# EAGLE design MK (EAGLE 9.4.2)
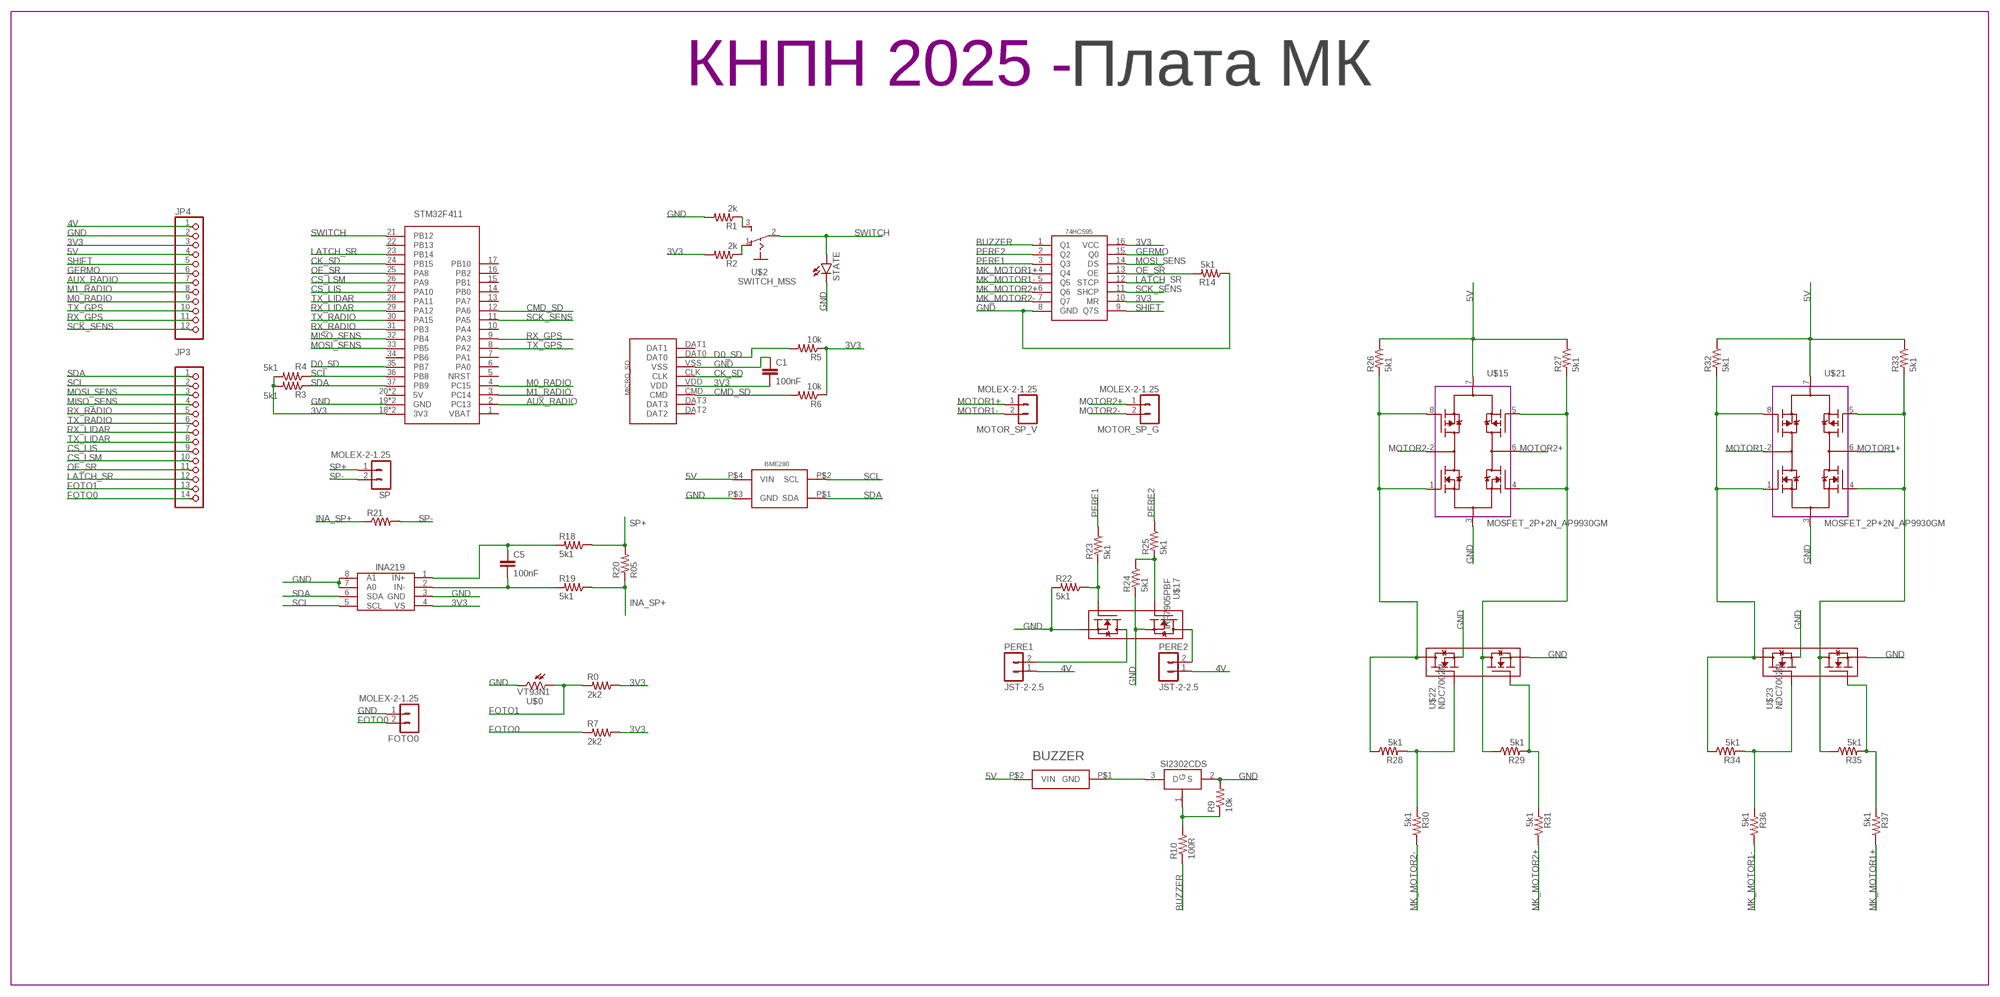
[diagram p0: schematic, sheet 1]

## Parts
BME280  BME280BME280-PINS-ONLY  [BME280-PINS-ONLY]
BUZZER  BUZZERS8R6  [BUZZER-S8R12]
C1  100nF  C-EUC0603  [C0603]
C5  100nF  C-EUC0603  [C0603]
FOTO0  MOLEX-2-1.25  [53047-02]
JP3  PINHD-1X14  [1X14]
JP4  PINHD-1X12  [1X12]
MICRO_SD  SD  [SD]
MOTOR_SP_G  MOLEX-2-1.25  [53047-02]
MOTOR_SP_V  MOLEX-2-1.25  [53047-02]
PERE1  JST-2-2.5  [JST-2-2.5]
PERE2  JST-2-2.5  [JST-2-2.5]
R0  2k2  R-US_R0603  [R0603]
R1  2k  R-US_R0603  [R0603]
R2  2k  R-US_R0603  [R0603]
R3  5k1  R-US_R0603  [R0603]
R4  5k1  R-US_R0603  [R0603]
R5  10k  R-US_R0603  [R0603]
R6  10k  R-US_R0603  [R0603]
R7  2k2  R-US_R0603  [R0603]
R9  10k  R-US_R0603  [R0603]
R10  100R  R-US_R0603  [R0603]
R14  5k1  R-US_R0603  [R0603]
R18  5k1  R-US_R0603  [R0603]
R19  5k1  R-US_R0603  [R0603]
R20  R05  R-US_R2512  [R2512]
R21  R-US_0207/15  [0207/15]
R22  5k1  R-US_R0603  [R0603]
R23  5k1  R-US_R0603  [R0603]
R24  5k1  R-US_R0603  [R0603]
R25  5k1  R-US_R0603  [R0603]
R26  5k1  R-US_R0603  [R0603]
R27  5k1  R-US_R0603  [R0603]
R28  5k1  R-US_R0603  [R0603]
R29  5k1  R-US_R0603  [R0603]
R30  5k1  R-US_R0603  [R0603]
R31  5k1  R-US_R0603  [R0603]
R32  5k1  R-US_R0603  [R0603]
R33  5k1  R-US_R0603  [R0603]
R34  5k1  R-US_R0603  [R0603]
R35  5k1  R-US_R0603  [R0603]
R36  5k1  R-US_R0603  [R0603]
R37  5k1  R-US_R0603  [R0603]
SI2302CDS  SI2302CDS  [SOT23-3]
SP  MOLEX-2-1.25  [53047-02]
STATE  LEDCHIPLED_0603  [CHIPLED_0603]
STM32F411  STM32F411_BOARD  [STM32F411_BOARD]
U$0  VT93N1  [VT93N1]
U$1  Плата МК  LOGOPCB-""  [LOGO]
U$2  SWITCH_MSS  [SWITCH_MSS]
U$13  74HC595  [TSSOP16]
U$15  MOSFET_2P+2N_AP9930GM  [SO8]
U$16  INA219AID  [SOT23-8]
U$17  IRF7905PBF  [SO8]
U$21  MOSFET_2P+2N_AP9930GM  [SO8]
U$22  NDC7002N  [SOT23-6]
U$23  NDC7002N  [SOT23-6]

## Nets
3V3: C1.2 JP4.3 MICRO_SD.VDD R0.1 R2.2 R3.2 R4.2 R5.1 R6.1 R7.1 STM32F411.18(3V3) STM32F411.40(3V3) U$13.10(MR) U$13.16(VCC) U$16.4(VS)
4V: JP4.1 PERE1.1 PERE2.1
5V: BME280.P$4(VIN) BUZZER.P$2(VIN) JP4.4 R26.1 R27.1 R32.1 R33.1 U$15.7(P1P2S) U$21.7(P1P2S)
AUX_RADIO: JP4.7 STM32F411.2(PC13)
BUZZER: R10.1 U$13.1(Q1)
CK_SD: MICRO_SD.CLK STM32F411.24(PB15)
CMD_SD: MICRO_SD.CMD R6.2 STM32F411.12(PA6)
CS_LIS: JP3.9 STM32F411.27(PA10)
CS_LSM: JP3.10 STM32F411.26(PA9)
D0_SD: MICRO_SD.DAT0 R5.2 STM32F411.35(PB7)
FOTO0: FOTO0.2 JP3.14 R7.2
FOTO1: JP3.13 R0.2 U$0.P$1
GERMO: JP4.6 U$13.15(Q0)
GND: BME280.P$3(GND) C1.1 FOTO0.1 JP4.2 MICRO_SD.VSS R1.2 R9.2 R14.1 R22.2 R24.2 SI2302CDS.2(S) STATE.C STM32F411.19(GND) STM32F411.39(GND) U$0.P$2 U$13.8(GND) U$15.3(N1N2S) U$16.3(GND) U$16.7(A0) U$16.8(A1) U$17.1(S2) U$17.3(S1) U$21.3(N1N2S) U$22.2(S2) U$22.5(S1) U$23.2(S2) U$23.5(S1)
INA_SP+: R19.1 R20.1 R21.1
LATCH_SR: JP3.12 STM32F411.23(PB14) U$13.12(STCP)
M0_RADIO: JP4.9 STM32F411.4(PC15)
M1_RADIO: JP4.8 STM32F411.3(PC14)
MISO_SENS: JP3.4 STM32F411.32(PB4)
MK_MOTOR1+: R37.1 U$13.4(Q4)
MK_MOTOR1-: R36.1 U$13.5(Q5)
MK_MOTOR2+: R31.1 U$13.6(Q6)
MK_MOTOR2-: R30.1 U$13.7(Q7)
MOSI_SENS: JP3.3 STM32F411.33(PB5) U$13.14(DS)
MOTOR1+: MOTOR_SP_V.1 U$21.6(P2N2D)
MOTOR1-: MOTOR_SP_V.2 U$21.2(P1N1D)
MOTOR2+: MOTOR_SP_G.1 U$15.6(P2N2D)
MOTOR2-: MOTOR_SP_G.2 U$15.2(P1N1D)
N$1: R1.1 U$2.3(S)
N$2: R2.1 U$2.1(O)
N$13: BUZZER.P$1(GND) SI2302CDS.3(D)
N$14: R9.1 R10.2 SI2302CDS.1(G)
N$15: C5.2 R19.2 U$16.2(IN-)
N$18: C5.1 R18.2 U$16.1(IN+)
N$20: PERE1.2 U$17.7(D2) U$17.8(D2)
N$21: PERE2.2 U$17.5(D1) U$17.6(D1)
N$22: R22.1 R23.2 U$17.2(G2)
N$23: R24.1 R25.2 U$17.4(G1)
N$24: R32.2 R34.1 U$21.1(N1G) U$21.8(P1G) U$23.6(D1)
N$25: R26.2 R28.1 U$15.1(N1G) U$15.8(P1G) U$22.6(D1)
N$26: R27.2 R29.1 U$15.4(N2G) U$15.5(P2G) U$22.4(D2)
N$27: R33.2 R35.1 U$21.4(N2G) U$21.5(P2G) U$23.4(D2)
N$28: R34.2 R36.2 U$23.1(G1)
N$29: R35.2 R37.2 U$23.3(G2)
N$32: R28.2 R30.2 U$22.1(G1)
N$35: R29.2 R31.2 U$22.3(G2)
OE_SR: JP3.11 R14.2 STM32F411.25(PA8) U$13.13(OE)
PERE1: R23.1 U$13.3(Q3)
PERE2: R25.1 U$13.2(Q2)
RX_GPS: JP4.11 STM32F411.9(PA3)
RX_LIDAR: JP3.7 STM32F411.29(PA12)
RX_RADIO: JP3.5 STM32F411.31(PB3)
SCK_SENS: JP4.12 STM32F411.11(PA5) U$13.11(SHCP)
SCL: BME280.P$2(SCL) JP3.2 R4.1 STM32F411.36(PB8) U$16.5(SCL)
SDA: BME280.P$1(SDA) JP3.1 R3.1 STM32F411.37(PB9) U$16.6(SDA)
SHIFT: JP4.5 U$13.9(Q7S)
SP+: R18.1 R20.2 SP.1
SP-: R21.2 SP.2
SWITCH: STATE.A STM32F411.21(PB12) U$2.2(P)
TX_GPS: JP4.10 STM32F411.8(PA2)
TX_LIDAR: JP3.8 STM32F411.28(PA11)
TX_RADIO: JP3.6 STM32F411.30(PA15)
Unconnected: MICRO_SD.DAT1 MICRO_SD.DAT2 MICRO_SD.DAT3 STM32F411.1(VBAT) STM32F411.5(NRST) STM32F411.6(PA0) STM32F411.7(PA1) STM32F411.10(PA4) STM32F411.13(PA7) STM32F411.14(PB0) STM32F411.15(PB1) STM32F411.16(PB2) STM32F411.17(PB10) STM32F411.20(5V) STM32F411.22(PB13) STM32F411.34(PB6) STM32F411.38(5V)

## Library data of the parts
BME280 = UNKNOWN-2024:BME280
BUZZER = CanCubeSat:BUZZER
C1 C5 = rcl:C-EU: CAPACITOR, European symbol; SPICEPREFIX: C
FOTO0 MOTOR_SP_G MOTOR_SP_V SP = UNKNOWN-2024:MOLEX-2-1.25
JP3 = pinhead:PINHD-1X14: PIN HEADER
JP4 = pinhead:PINHD-1X12: PIN HEADER
MICRO_SD = UNKNOWN-2024:SD
PERE1 PERE2 = UNKNOWN-2024:JST-2-2.5: JST PH series header 2.00mm pitch disconnectable crimp style connectors, vertical (side entry type), 2 pins
R0 R1-R7 R9 R10 R14 R18-R37 = rcl:R-US_: RESISTOR, American symbol; SPICEPREFIX: R
SI2302CDS = CanCubeSat:SI2302CDS
STATE = led:LED: LED OSRAM: - CHIPLED LG R971, LG N971, LY N971, LG Q971, LY Q971, LO R971, LY R971 LH N974, LH R974 LS Q976, LO Q976, LY Q976 LO Q996 - Hyper CHIPLED LW Q18S LB Q993, LB Q99A, LB R99A - SideLED LS A670, LO A670, LY A670, LG A670, LP A670 LB A673, LV A673, LT A673, LW A673 LH A674 LY A675 LS A676, LA A676, LO A676, LY A676, LW A676 LS A679, LY A679, LG A679 - Hyper Micro SIDELED® LS Y876, LA Y876, LO Y876, LY Y876 LT Y87S - SmartLED LW L88C, LW L88S LB L89C, LB L89S, LG L890 LS L89K, LO L89K, LY L89K LS L896, LA L896, LO L896, LY L896 - TOPLED LS T670, LO T670, LY T670, LG T670, LP T670 LSG T670, LSP T670, LSY T670, LOP T670, LYG T670 LG T671, LOG T671, LSG T671 LB T673, LV T673, LT T673, LW T673 LH T674 LS T676, LA T676, LO T676, LY T676, LB T676, LH T676, LSB T676, LW T676 LB T67C, LV T67C, LT T67C, LS T67K, LO T67K, LY T67K, LW E67C LS E67B, LA E67B, LO E67B, LY E67B, LB E67C, LV E67C, LT E67C LW T67C LS T679, LY T679, LG T679 LS T770, LO T770, LY T770, LG T770, LP T770 LB T773, LV T773, LT T773, LW T773 LH T774 LS E675, LA E675, LY E675, LS T675 LS T776, LA T776, LO T776, LY T776, LB T776 LHGB T686 LT T68C, LB T68C - Hyper Mini TOPLED® LB M676 - Mini TOPLED Santana® LG M470 LS M47K, LO M47K, LY M47K Source: http://www.osram.convergy.de LUXEON: - LUMILED® LXK2-PW12-R00, LXK2-PW12-S00, LXK2-PW14-U00, LXK2-PW14-V00 LXK2-PM12-R00, LXK2-PM12-S00, LXK2-PM14-U00 LXK2-PE12-Q00, LXK2-PE12-R00, LXK2-PE12-S00, LXK2-PE14-T00, LXK2-PE14-U00 LXK2-PB12-K00, LXK2-PB12-L00, LXK2-PB12-M00, LXK2-PB14-N00, LXK2-PB14-P00, LXK2-PB14-Q00 LXK2-PR12-L00, LXK2-PR12-M00, LXK2-PR14-Q00, LXK2-PR14-R00 LXK2-PD12-Q00, LXK2-PD12-R00, LXK2-PD12-S00 LXK2-PH12-R00, LXK2-PH12-S00 LXK2-PL12-P00, LXK2-PL12-Q00, LXK2-PL12-R00 Source: www.luxeon.com KINGBRIGHT: KA-3528ASYC Source: www.kingbright.com
STM32F411 = UNKNOWN-2024:STM32F411_BOARD
U$0 = KNPN-2023:VT93N1
U$1 = UNKNOWN-2024:LOGO
U$2 = UNKNOWN-2024:SWITCH_MSS
U$13 = CanCubeSat:74HC595
U$15 U$21 = UNKNOWN-2024:MOSFET_2P+2N_AP9930GM
U$16 = CanCubeSat:INA219AID
U$17 = UNKNOWN-2024:IRF7905PBF
U$22 U$23 = UNKNOWN-2024:NDC7002N

## Board
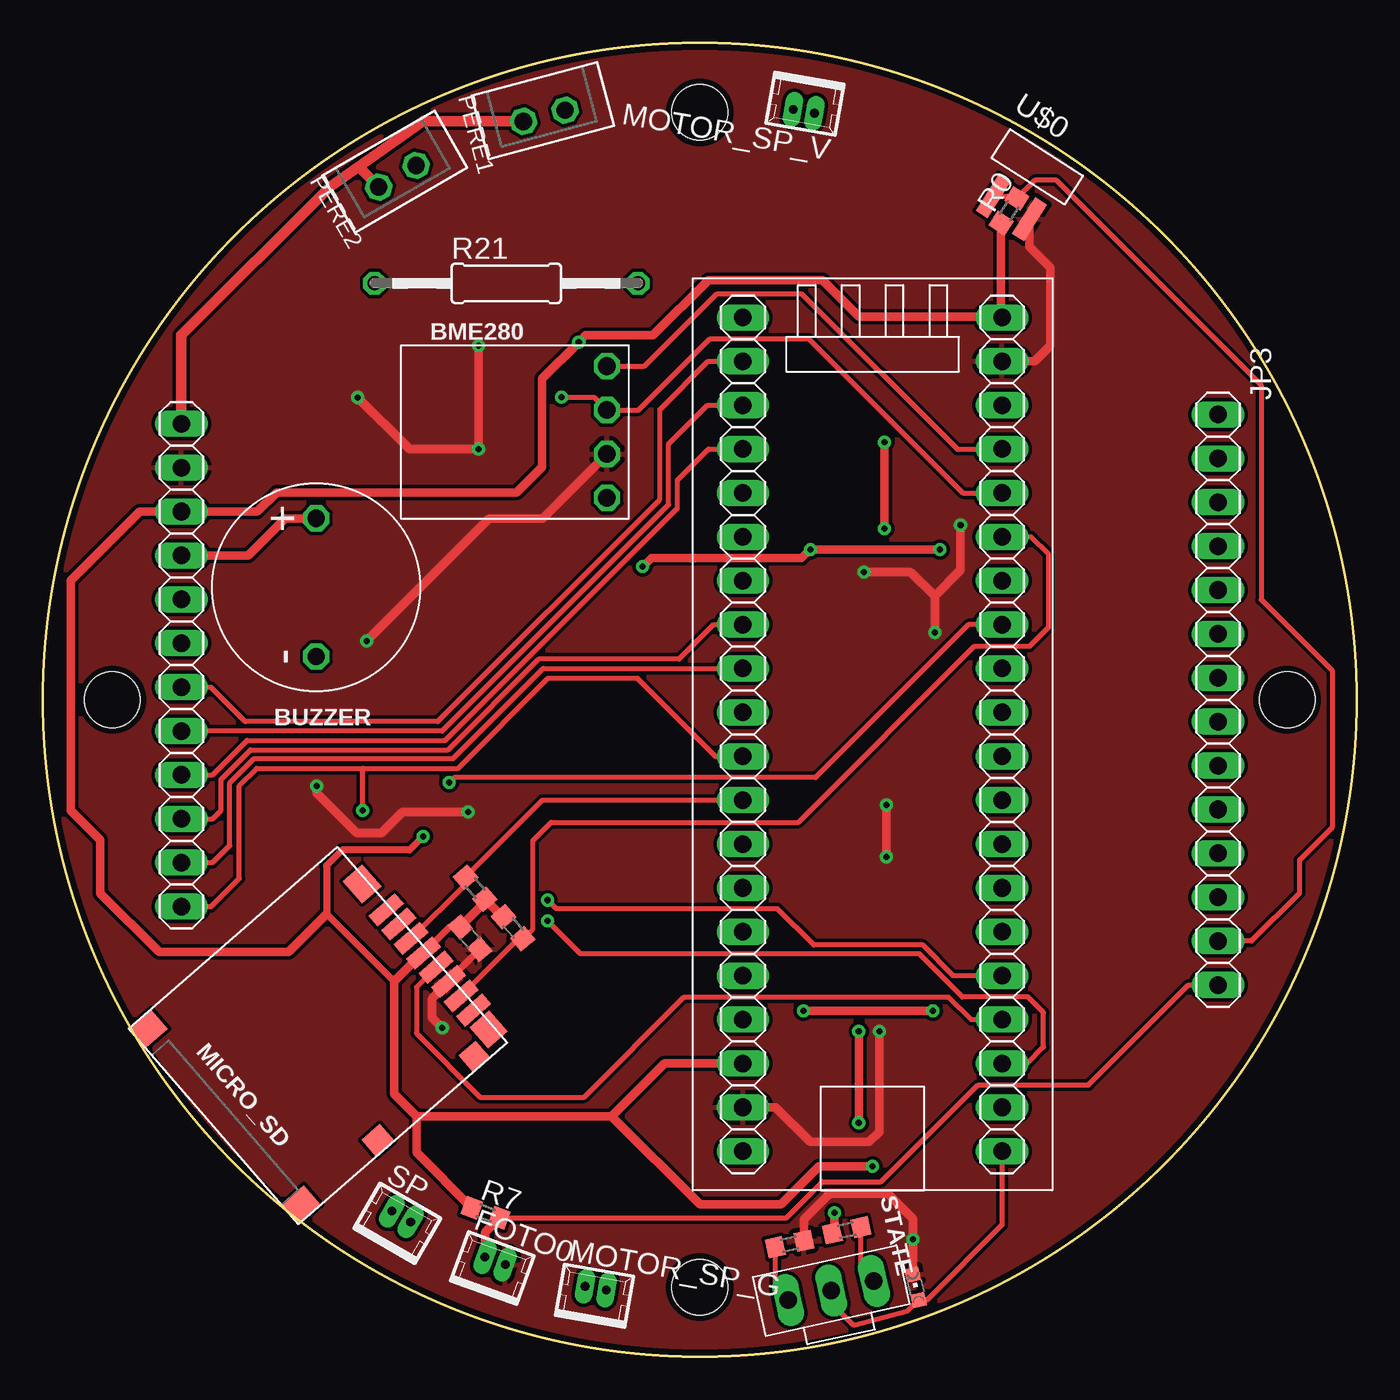
[diagram p1: board, top side]
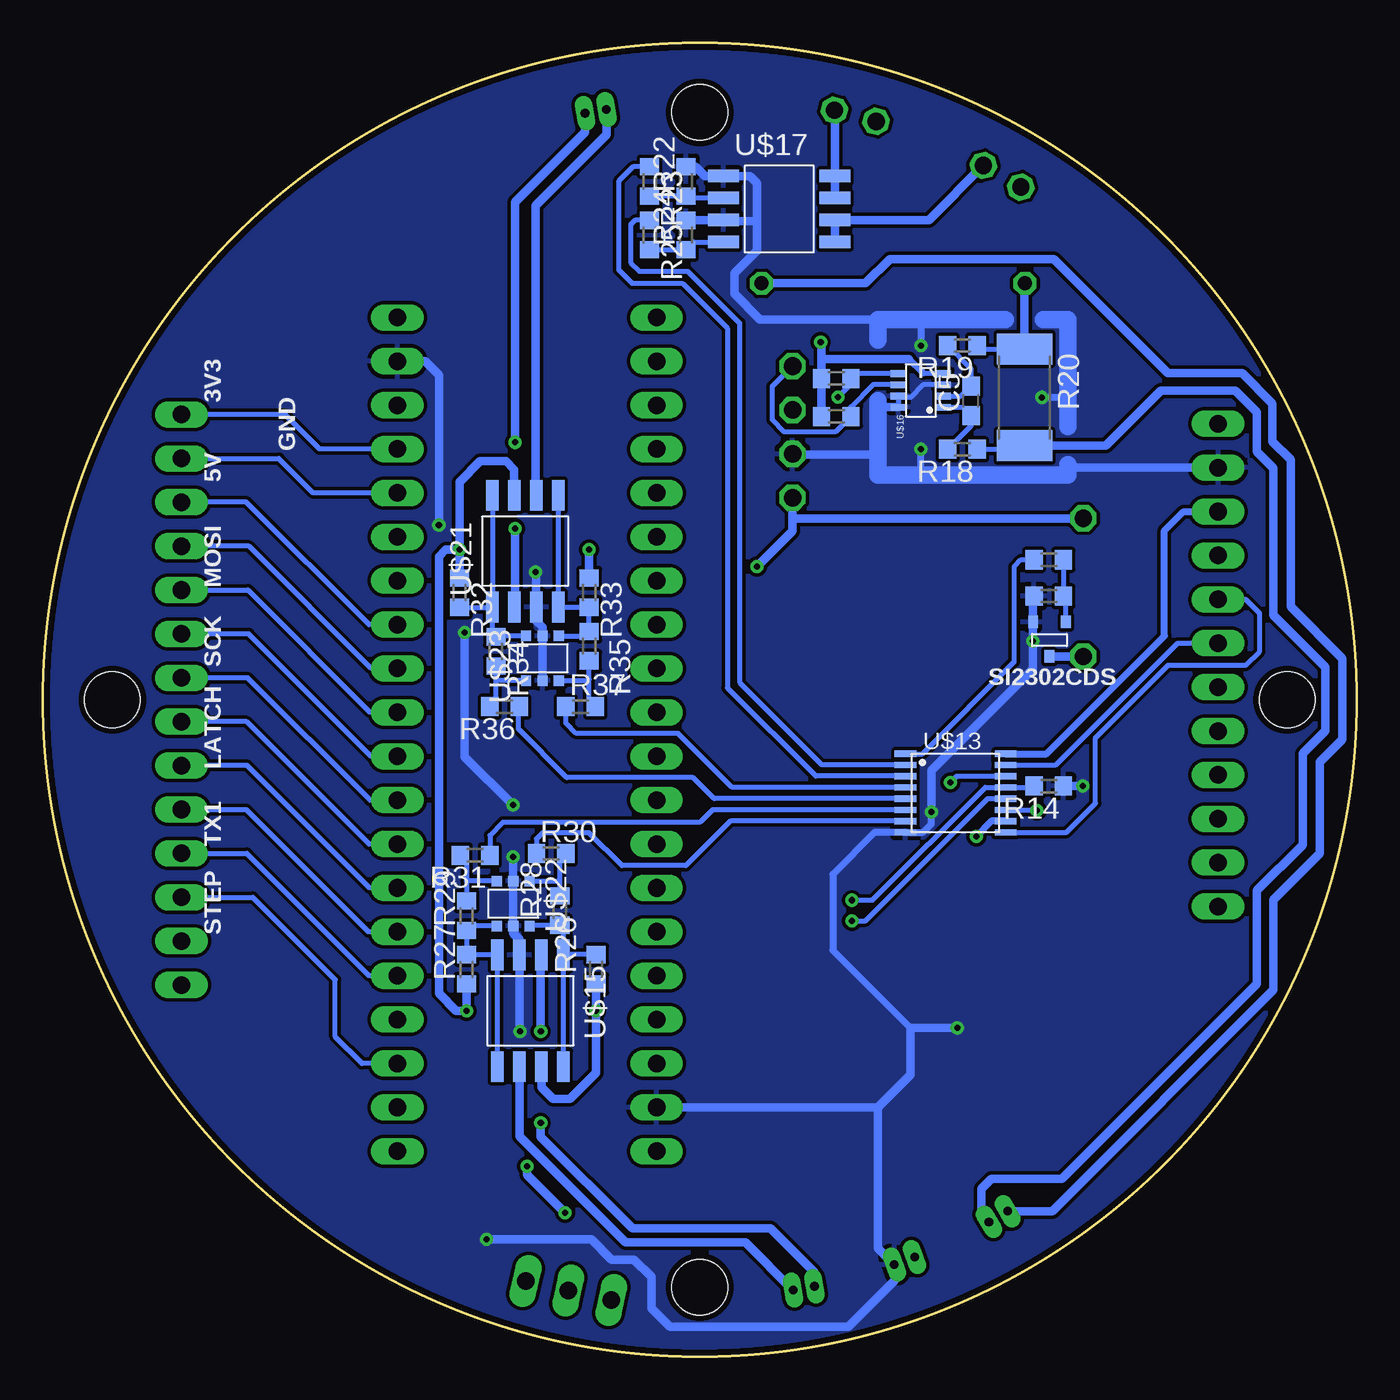
[diagram p2: board, bottom side, seen from below]

Size 76 x 76 mm. Coordinates in mm from the lower left corner, seen from the top.
Outline: circle at 38,38 radius 38
Copper layers (1*16): Top 0.035mm / dielectric 1.5mm / Bottom 0.035mm
Design rules "default *": minimum track width 0.3mm, minimum drill 0.35mm, track to track 0.2mm, track to pad 0.2mm, pad to pad 0.2mm, via to via 0.2mm, smd to smd 0.2mm, copper to edge 0.35mm, drill to drill 0.2mm, minimum pad ring 10mil, minimum via ring 8mil, stop-mask expansion 4mil, vias tented up to drill 0mil, thermal gap 10mil
Holes 3.2 mm at 4,38 38,4 72,38 38,72

### Footprints (pad centres in the part's own frame; a part is rotated, then mirrored left to right if it is on the bottom)
BME280-PINS-ONLY = drill 1.016 octagon: P$1 -3.81,5.33; P$2 -1.27,5.33; P$3 1.27,5.33; P$4 3.81,5.33
BUZZER-S8R12 = drill 1 octagon: P$1 -4,0; P$2 4,0
C0603 = smd 1.1 x 1: 1 -0.85,0; 2 0.85,0
53047-02 = drill 0.5 pad 0.698 long: 1 0.625,0.45; 2 -0.625,0.45
1X14 = drill 1.016 long: 1 -16.51,0; 2 -13.97,0; 3 -11.43,0; 4 -8.89,0; 5 -6.35,0; 6 -3.81,0; 7 -1.27,0; 8 1.27,0; 9 3.81,0; 10 6.35,0; 11 8.89,0; 12 11.43,0; 13 13.97,0; 14 16.51,0
1X12 = drill 1.016 long: 1 -13.97,0; 2 -11.43,0; 3 -8.89,0; 4 -6.35,0; 5 -3.81,0; 6 -1.27,0; 7 1.27,0; 8 3.81,0; 9 6.35,0; 10 8.89,0; 11 11.43,0; 12 13.97,0
SD = smd 0.8 x 2: CLK 6,-15.77; CMD 8.2,-15.77; DAT0 3.8,-15.77; DAT1 2.7,-15.77; DAT2 10.4,-15.77; DAT3 9.3,-15.77; VDD 7.1,-15.77; VSS 4.9,-15.77 | smd 1.5 x 1.7: P$9 0.75,-0.85; P$13 14.25,-0.85 | smd 1.6 x 1.5: P$10 1.3,-15.7 | smd 1.29 x 1.3: P$11 0.645,-14.05 | smd 1.29 x 1.4: P$12 0.645,-6.65 | smd 1.7 x 1.5: P$14 12.45,-15.7
JST-2-2.5 = drill 1 pad 1.5 octagon: 1 1.25,0; 2 -1.25,0
R0603 = smd 1 x 1.1: 1 -0.85,0; 2 0.85,0
R2512 = smd 1.8 x 3.2: 1 -2.8,0; 2 2.8,0
0207/15 = drill 0.813 octagon: 1 -7.62,0; 2 7.62,0
SOT23-3 = smd 0.56 x 0.73: 1 -0.95,-1; 2 0.95,-1; 3 0,1
CHIPLED_0603 = smd 0.8 x 0.8: A 0,-0.75; C 0,0.75
STM32F411_BOARD = drill 1.016 long: 1 24.13,7.5; 2 21.59,7.5; 3 19.05,7.5; 4 16.51,7.5; 5 13.97,7.5; 6 11.43,7.5; 7 8.89,7.5; 8 6.35,7.5; 9 3.81,7.5; 10 1.27,7.5; 11 -1.27,7.5; 12 -3.81,7.5; 13 -6.35,7.5; 14 -8.89,7.5; 15 -11.43,7.5; 16 -13.97,7.5; 17 -16.51,7.5; 18 -19.05,7.5; 19 -21.59,7.5; 20 -24.13,7.5; 21 -24.13,-7.5; 22 -21.59,-7.5; 23 -19.05,-7.5; 24 -16.51,-7.5; 25 -13.97,-7.5; 26 -11.43,-7.5; 27 -8.89,-7.5; 28 -6.35,-7.5; 29 -3.81,-7.5; 30 -1.27,-7.5; 31 1.27,-7.5; 32 3.81,-7.5; 33 6.35,-7.5; 34 8.89,-7.5; 35 11.43,-7.5; 36 13.97,-7.5; 37 16.51,-7.5; 38 19.05,-7.5; 39 21.59,-7.5; 40 24.13,-7.5
VT93N1 = smd 0.8 x 2.5: P$1 -1.25,-1.8; P$2 1.25,-1.8
SWITCH_MSS = drill 1.016 long: 1 -2.54,0; 2 0,0; 3 2.54,0
TSSOP16 = smd 1.26 x 0.36: 1 -2.9,2.275; 2 -2.9,1.625; 3 -2.9,0.975; 4 -2.9,0.325; 5 -2.9,-0.325; 6 -2.9,-0.975; 7 -2.9,-1.625; 8 -2.9,-2.275; 9 2.9,-2.275; 10 2.9,-1.625; 11 2.9,-0.975; 12 2.9,-0.325; 13 2.9,0.325; 14 2.9,0.975; 15 2.9,1.625; 16 2.9,2.275
SO8 = smd 0.72 x 1.78: 1 -1.905,-3.23; 2 -0.635,-3.23; 3 0.635,-3.23; 4 1.905,-3.23; 5 1.905,3.23; 6 0.635,3.23; 7 -0.635,3.23; 8 -1.905,3.23
SOT23-8 = smd 0.9 x 0.4: 1 -1.3,0.975; 2 -1.3,0.325; 3 -1.3,-0.325; 4 -1.3,-0.975; 5 1.3,-0.975; 6 1.3,-0.325; 7 1.3,0.325; 8 1.3,0.975
SOT23-6 = smd 0.6 x 0.6: 1 -0.95,-1.3; 2 0,-1.3; 3 0.95,-1.3; 4 0.95,1.3; 5 0,1.3; 6 -0.95,1.3

### Placement (x,y rotation side)
BME280  27.3,53.5 270 top
BUZZER  15.8,44.5 90 top
C1  24.7,24.2 131 top
C5  22.3,55.3 90 bottom
FOTO0  26,5.1 340 top
JP3  68,38 270 top
JP4  8,40 270 top
MICRO_SD  14.78,7.65 131 top
MOTOR_SP_G  31.9,3.5 350 top
MOTOR_SP_V  44.1,72.5 170 top
PERE1  29,71.8 195 top
PERE2  20.5,68.3 210 top
R0  55.9,66.3 57.5 top
R1  43.2,6.5 12.5 top
R2  46.5,7.3 192.5 top
R3  30.1,54.4 180 bottom
R4  30.1,56.6 180 bottom
R5  27.2,24.8 311 top
R6  25,27.1 131 top
R7  25.6,8.3 340 top
R9  17.8,44 180 bottom
R10  17.8,46.1 0 bottom
R14  17.8,33 180 bottom
R18  22.8,52.5 180 bottom
R19  22.8,58.5 180 bottom
R20  19.2,55.5 270 bottom
R21  26.8,62.1 0 top
R22  38.8,68 90 bottom
R23  40.9,68 270 bottom
R24  38.8,64.9 90 bottom
R25  40.9,64.9 270 bottom
R26  44,22.4 90 bottom
R27  51.5,22.4 90 bottom
R28  46.1,25.8 90 bottom
R29  51.5,25.5 90 bottom
R30  46.6,29.1 0 bottom
R31  51,29 180 bottom
R32  51.9,44.2 270 bottom
R33  44.4,44.2 270 bottom
R34  49.8,40.8 270 bottom
R35  44.4,41.1 270 bottom
R36  49.3,37.6 180 bottom
R37  44.9,37.6 0 bottom
SI2302CDS  17.76,41.51 180 bottom
SP  20.5,7.7 330 top
STATE  50.5,4 12.5 top
STM32F411  48,36 90 top
U$0  57,68 327.5 top
U$1  80.4,18.5 0 top  (outside the outline)
U$2  45.6,3.8 192.5 top
U$13  23.2,32.6 0 bottom
U$15  47.8,20 180 bottom
U$16  25.2,55.9 180 bottom
U$17  33.4,66.4 270 bottom
U$21  48.1,46.6 0 bottom
U$22  48.8,26.2 180 bottom
U$23  47.1,40.4 0 bottom

### Tracks (layer width: path | path; a pad name or v marks a point on that pad's centre or on a via)
3V3  (via drill 0.35)
  Top 0.4: MICRO_SD.VDD 23.51,24.84 C1.2 | v22,30.1 21.2,29.3 17.3,29.3 16.4,28.4 16.4,25.6 20.3,21.7
  Top 0.5: C1.2 25.56,26.26 R6.1 26.57,25.44 R5.1 | R0.1 55.44,60.19 | 55.44,60.19 STM32F411.40 | R7.1 21.6,11.79 21.6,13.9 | 21.6,13.9 20.3,15.2 20.3,21.7 21.95,23.35 MICRO_SD.VDD | 55.44,60.19 47.21,60.19 45.1,62.3 38.5,62.3 35.3,59.1 31.4,59.1 v31,58.7 28.88,56.58 28.88,51.48 27.4,50 13.5,50 12.39,48.89 JP4.3 5.59,48.89 1.6,44.9 1.6,31.6 3.3,29.9 3.3,26.8 6.7,23.4 14.2,23.4 16.4,25.6 | 21.6,13.9 32.9,13.9 | STM32F411.18 35.95,16.95 32.9,13.9 | 32.9,13.9 38,8.8 42.7,8.8 44.9,11 v48,11 | v45.8,8.3 45.8,7.25 R2.2
  Bottom 0.3: U$16.4 25.03,56.88 25.08,56.92
  Bottom 0.4: 25.08,56.92 25.88,57.73 | U$13.16 17.93,34.88 11.1,41.7 11.1,47.8 10.01,48.89 JP4.3 | U$13.10 21.12,30.98 v22,30.1
  Bottom 0.5: R3.2 R4.2 30.95,57.7 | 30.95,57.7 30.95,58.65 v31,58.7 | 30.95,57.7 30.92,57.73 25.88,57.73 | v48,11 48,10.5 v45.8,8.3
4V
  Top 0.6: JP4.1 8,59.1 16.6,67.7 18.26,68.86 | 18.26,68.86 21.99,71.48 PERE1.1 | PERE2.1 19.42,67.7 18.26,68.86
5V  (via drill 0.35)
  Top 0.5: v44,20 v51.5,20 | v51.9,46.7 v44.4,46.7 43.9,46.2 35.2,46.2 v34.7,45.7 | JP4.4 11.85,46.35 14,48.5 BUZZER.P$2
  Bottom 0.5: U$15.7 47.16,15.57 46.5,14.9 45.5,14.9 44,16.4 v44,20 R26.1 | R27.1 v51.5,20 52.1,20 53.1,21 53.1,46.3 52.7,46.7 v51.9,46.7 | U$21.7 48.73,51.34 49.2,51.8 50.7,51.8 51.9,50.6 v51.9,46.7 | v51.9,46.7 R32.1 | v44.4,46.7 R33.1 | v34.7,45.7 32.63,47.77 32.63,48.5 | 32.63,48.5 BME280.P$4 | BUZZER.P$2 32.63,48.5
AUX_RADIO
  Top 0.3: JP4.7 9.7,38.73 11.7,36.73 22.83,36.73 35.7,49.6 35.7,54.8 38.49,57.59 STM32F411.2
BUZZER
  Bottom 0.3: U$13.1 25.12,34.88 19.8,40.2 19.8,45.7 19.4,46.1 R10.1
CK_SD
  Top 0.3: MICRO_SD.CLK 21.6,21.38 21.6,18.7 25.3,15 31.3,15 37.1,20.8 52.4,20.8 53.71,19.49 STM32F411.24
CMD_SD
  Top 0.3: MICRO_SD.CMD 24.44,27.32 R6.2 28.89,32.19 STM32F411.12
CS_LIS
  Bottom 0.3: STM32F411.27 57.11,27.11 64.2,34.2 64.2,34.19 JP3.9
CS_LSM
  Bottom 0.3: STM32F411.26 57.17,24.57 64.25,31.65 JP3.10
D0_SD
  Top 0.3: MICRO_SD.DAT0 27.48,24.16 R5.2 28.35,24.75 28.35,29.85 29.4,30.9 43.7,30.9 53.9,41.1 57.1,41.1 58.2,42.2 58.2,46.4 57.17,47.43 STM32F411.35
FOTO0
  Top 0.3: R7.2 43.01,8.01 45.1,10.1 48.5,10.1 54.1,15.7 60.5,15.7 66.29,21.49 JP3.14
  Top 0.5: FOTO0.2 25.57,7.18 R7.2
FOTO1
  Top 0.3: U$0.P$1 56.22,67.15 R0.2 57.44,68.1 58.6,68.1 70.5,56.2 70.5,43.8 74.6,39.7 74.6,30.6 72.7,28.7 72.7,26.8 69.93,24.03 JP3.13
GERMO
  Bottom 0.3: U$13.15 17.38,34.23 10.33,41.27 JP4.6
GND  (via drill 0.35)
  Top 0.4: MICRO_SD.VSS 23.47,21.77 C1.1
  Top 0.5: v18.2,55.5 21.2,52.5 v25.2,52.5 v25.2,58.5 | v48.4,18.8 48.4,13 47.8,12.4 44.4,12.4 42.39,14.41 STM32F411.19 | U$0.P$2 57.09,64.21 58.3,63 58.3,58.5 57.39,57.59 STM32F411.39 | R1.2 44.03,7.93 45.5,9.4 48.9,9.4 50.34,7.96 v50.34,6.76 STATE.C | MICRO_SD.VSS 22.5,20.73 22.5,19.6 v23.1,19 | v24.6,31.5 20.8,31.5 19.6,30.3 18.13,30.3 15.83,32.6 v15.83,33 | v18.71,41.4 25.81,48.5 28.9,48.5 BME280.P$3 | v47.5,45.4 50.2,45.4 51.6,44 | 51.6,44 v51.6,41.9 | v48.8,31.9 v48.8,28.9 | v53.1,48.1 53.1,45.5 51.6,44
  Bottom 0.3: U$16.3 25.07,56.23 25.8,55.5 26.43,55.5 U$16.7 U$16.8
  Bottom 0.4: 25.2,60 v25.2,58.5 | 25.2,51 v25.2,52.5 | 16.7,55.5 v18.2,55.5 | 25.8,19 30.3,23.5 30.3,27.9 27.88,30.33 U$13.8 25.07,30.33 24.6,30.8 v24.6,31.5
  Bottom 0.5: U$23.2 U$23.5 47.1,42.2 47.47,42.56 U$21.3 47.47,45.37 v47.5,45.4 | R22.2 38.25,68.85 37.7,68.3 U$17.1 | U$17.1 | R24.2 38.78,65.77 U$17.3 36.56,65.7 34.7,65.7 | U$16.8 27.57,54.92 27.7,54.8 | R9.2 18.71,43.94 SI2302CDS.2 v18.71,41.4 18.71,39.79 24.6,33.9 v24.6,31.5 | U$17.1 35.1,68.3 34.7,67.9 34.7,65.7 | BME280.P$3 32.6,52.2 27.7,52.2 | v48.4,18.8 48.44,18.84 U$15.3 48.44,24.14 48.8,24.5 U$22.5 U$22.2 v48.8,28.9 | JP4.2 16.53,51.43 16.7,51.6 | v50.34,6.76 44.26,6.76 43.1,5.6 41.8,5.6 40.8,4.6 40.8,2.79 39.71,1.7 29.4,1.7 26.74,4.36 FOTO0.1 27.69,6.26 27.69,14.41 | 27.69,14.41 STM32F411.19 | v23.1,19 25.8,19 25.8,16.3 27.69,14.41 | R14.1 v15.83,33 | 27.7,60 34.5,60 36,61.5 36,62.7 34.7,64 34.7,65.7 | v51.6,41.9 51.6,34.7 v48.8,31.9 | STM32F411.39 53.89,57.59 53.1,56.8 v53.1,48.1
  Bottom 1: 27.7,55.3 27.7,54.8 27.7,52.2 27.7,51 25.2,51 16.7,51 16.7,51.6 | 18.1,60 16.7,60 16.7,55.5 16.7,53.8 | 27.7,58.8 27.7,60 25.2,60 20.3,60
  pour Bottom: 20.8,78.6 57.8,78.6 78.3,58.1 78.3,8.1 67.1,-3.1 12.8,-3.1 -3.1,12.8 -3.1,54.7
  pour Top: -4.1,54.7 21,79.8 58.1,79.8 79.4,58.5 79.4,7.8 67.7,-3.9 12.8,-3.9 -4.1,13
INA_SP+
  Bottom 0.3: R19.1 21.75,58.3 R20.1
  Bottom 0.5: R21.1 19.2,62.08 R20.1
LATCH_SR  (via drill 0.35)
  Top 0.3: STM32F411.23 56.95,16.95 57.9,17.9 57.9,19.9 57,20.8 53.2,20.8 50.7,23.3 31.1,23.3 v29.2,25.2
  Bottom 0.3: STM32F411.23 57.55,16.95 59.1,18.5 59.1,21.8 63.87,26.57 JP3.12 | v29.2,25.2 28.4,25.2 21.32,32.27 U$13.12
M0_RADIO
  Top 0.3: STM32F411.4 38.51,52.51 36.7,50.7 36.7,49.09 23.26,35.65 11.8,35.65 9.8,33.65 JP4.9
M1_RADIO
  Top 0.3: JP4.8 23.1,36.19 36.2,49.29 36.2,52.8 38.45,55.05 STM32F411.3
MISO_SENS
  Bottom 0.3: STM32F411.32 57.01,39.81 64.09,46.89 JP3.4
MK_MOTOR1+
  Bottom 0.3: U$13.4 36.12,32.92 39.26,36.06 45.16,36.06 45.75,36.65 R37.1
MK_MOTOR1-
  Bottom 0.3: U$13.5 37.17,32.27 38.4,33.5 45.7,33.5 48.5,36.3 48.5,37.55 R36.1
MK_MOTOR2+
  Bottom 0.3: U$13.6 37.27,31.62 38,30.9 49.4,30.9 50.15,30.15 R31.1
MK_MOTOR2-
  Bottom 0.3: U$13.7 36.23,30.98 38.8,28.4 42.5,28.4 44.4,30.3 47.1,30.3 47.45,29.95 R30.1
MOSI_SENS  (via drill 0.35)
  Top 0.3: STM32F411.33 53.55,42.35 44.7,33.5 23.8,33.5 v23.5,33.2
  Bottom 0.3: STM32F411.33 57.15,42.35 64.22,49.42 64.22,49.43 JP3.3 | v23.5,33.2 23.12,33.58 U$13.14
MOTOR1+
  Bottom 0.5: MOTOR_SP_V.1 43.41,70.69 47.5,66.6 47.5,49.87 U$21.6
MOTOR1-  (via drill 0.35)
  Top 0.5: v48.7,52.9 v48.7,47.9
  Bottom 0.5: MOTOR_SP_V.2 44.64,70.86 48.7,66.8 v48.7,52.9 | v48.7,47.9 48.7,43.41 U$21.2
MOTOR2+
  Bottom 0.5: U$15.6 48.44,12.73 42.3,6.6 35.36,6.6 MOTOR_SP_G.1
MOTOR2-  (via drill 0.35)
  Top 0.5: v47.2,13.5 v47.2,18.8
  Bottom 0.5: MOTOR_SP_G.2 31.36,4.86 33.9,7.4 41.9,7.4 47.2,12.7 v47.2,13.5 | v47.2,18.8 47.2,23.2 U$15.2
N$1
  Top 0.3: U$2.3 42.37,4 R1.1
N$2
  Top 0.3: U$2.1 47.33,5.1 R2.1
N$13
  Bottom 0.5: BUZZER.P$1 SI2302CDS.3
N$14
  Bottom 0.3: R10.2 R9.1 16.81,43.86 SI2302CDS.1
N$15
  Bottom 0.3: R19.2 22.3,57.15 C5.2 22.88,55.58 U$16.2
N$18
  Bottom 0.3: R18.2 22.3,53.85 C5.1 22.77,54.92 U$16.1
N$20
  Bottom 0.5: U$17.7 U$17.8 30.17,72.09 PERE1.2
N$21
  Bottom 0.5: U$17.5 U$17.6 24.74,65.77 PERE2.2
N$22
  Bottom 0.3: U$17.2 38.69,67.03 R22.1 R23.2
N$23
  Bottom 0.3: U$17.4 38.35,64.5 R24.1 R25.2
N$24
  Bottom 0.3: U$21.1 50.01,41.85 R34.1 49.75,41.7 U$23.6 | R32.2 50.02,43.35 U$21.1 | U$21.8 U$21.1
N$25
  Bottom 0.3: U$15.8 U$15.1 | R26.2 45.88,23.25 U$15.1 | U$15.1 45.9,24.75 R28.1 47.8,24.95 U$22.6
N$26
  Bottom 0.3: U$15.5 U$15.4 51.48,23.23 R27.2 R29.1 51.25,24.9 U$22.4
N$27
  Bottom 0.3: U$21.5 U$21.4 44.42,43.37 R33.2 R35.1 44.65,41.7 U$23.4
N$28
  Bottom 0.3: R36.2 49.8,37.95 49.8,39.1 | 49.8,39.1 R34.2 | U$23.1 49.8,39.1
N$29
  Bottom 0.3: R37.2 44.4,37.95 44.4,39.2 | 44.4,39.2 R35.2 | U$23.3 44.5,39.1 44.4,39.2
N$32
  Bottom 0.3: R30.2 46.1,28.75 46.1,27.5 | 46.1,27.5 R28.2 | U$22.1 46.1,27.5
N$35
  Bottom 0.3: R31.2 51.5,28.65 51.5,27.5 | 51.5,27.5 R29.2 | U$22.3 51.5,27.5
OE_SR  (via drill 0.35)
  Top 0.3: STM32F411.25 52.68,22.03 50.91,23.8 44.6,23.8 42.5,25.9 29.7,25.9 v29.2,26.4
  Bottom 0.3: R14.2 18.73,32.92 U$13.13 21.48,32.92 28,26.4 v29.2,26.4 | STM32F411.25 57.13,22.03 64.21,29.11 JP3.11
PERE1
  Bottom 0.3: R23.1 41.85,68.85 42.7,68 42.7,62.89 41.91,62.1 39,62.1 36.4,59.5 36.4,38.69 31.28,33.58 U$13.3
PERE2
  Bottom 0.3: R25.1 41.75,65.75 42,65.5 42,63.3 41.5,62.8 38.7,62.8 35.7,59.8 35.7,39 30.92,34.23 U$13.2
RX_GPS
  Top 0.3: JP4.11 9.8,28.57 10.79,29.57 10.79,33.19 12.21,34.6 23.73,34.6 28.94,39.81 STM32F411.9
RX_LIDAR
  Bottom 0.3: STM32F411.29 57.09,32.19 64.18,39.28 64.19,39.27 JP3.7
RX_RADIO
  Bottom 0.3: STM32F411.31 57.07,37.27 64.15,44.35 JP3.5
SCK_SENS  (via drill 0.35)
  Top 0.3: JP4.12 9.73,26.03 11.35,27.65 11.35,33.04 12.34,34.03 18.5,34.03 | STM32F411.11 38.9,34.73 34.4,39.23 29.2,39.23 24,34.03 18.5,34.03 | v18.5,31.6 18.5,34.03
  Bottom 0.3: U$13.11 18.52,31.62 v18.5,31.6
SCL  (via drill 0.35)
  Top 0.3: v30.01,55.51 31.89,55.51 BME280.P$2 34.47,54.77 38.6,58.9 44.3,58.9 53.23,49.97 STM32F411.36
  Bottom 0.3: U$16.5 28.98,56.88 R4.1 29.25,56.27 v30.01,55.51 | STM32F411.36 60.37,49.97 62.37,51.97 JP3.2
SDA
  Top 0.3: BME280.P$1 34.81,57.31 39,61.5 43.9,61.5 52.9,52.5 STM32F411.37
  Bottom 0.3: U$16.6 27.98,56.23 29.25,54.95 R3.1 30.15,53.5 33.1,53.5 33.8,54.2 33.8,56.14 BME280.P$1 | STM32F411.37 60.01,52.51 62.01,54.51 JP3.1
SHIFT
  Bottom 0.3: U$13.9 16.77,30.33 15.1,32 15.1,35.79 10.89,40 6.4,40 5.6,40.8 5.6,43 6.41,43.81 JP4.5
SP+
  Bottom 0.3: R18.1 19.4,52.5 R20.2
  Bottom 0.5: R20.2 14.5,52.7 11.3,55.9 7,55.9 5.75,54.65 5.75,52.35 4.8,51.4 4.8,42.9 1.8,39.9 1.8,36.2 3.1,34.9 3.1,29.6 5.75,26.95 5.75,21.55 17.03,10.27 21.13,10.27 21.7,9.7 21.7,8.21 SP.1
SP-
  Bottom 0.5: SP.2 17.6,8.4 4.8,21.2 4.8,26.4 2.1,29.1 2.1,34.4 0.8,35.7 0.8,40.39 3.8,43.39 3.8,51.9 4.85,52.95 4.85,55.14 6.61,56.9 10.9,56.9 17.5,63.5 27,63.5 28.4,62.1 R21.2
SWITCH
  Top 0.3: STM32F411.21 55.5,7.6 51.17,3.27 STATE.A 50.03,2.64 46.9,1.8 45.6,3.1 U$2.2
TX_GPS
  Top 0.3: JP4.10 9.8,31.11 10.29,31.6 10.29,33.4 12,35.1 23.42,35.1 28.67,40.35 36.8,40.35 38.8,42.35 STM32F411.8
TX_LIDAR
  Bottom 0.3: STM32F411.28 57.15,29.65 64.23,36.73 JP3.8
TX_RADIO
  Bottom 0.3: STM32F411.30 57.03,34.73 64.11,41.8 64.1,41.81 JP3.6

### Text on the board
bNames: 3V3 | GND | 5V | MOSI | SCK | LATCH | TX1 | STEP